# EAGLE design ctp (EAGLE 7.2.0)
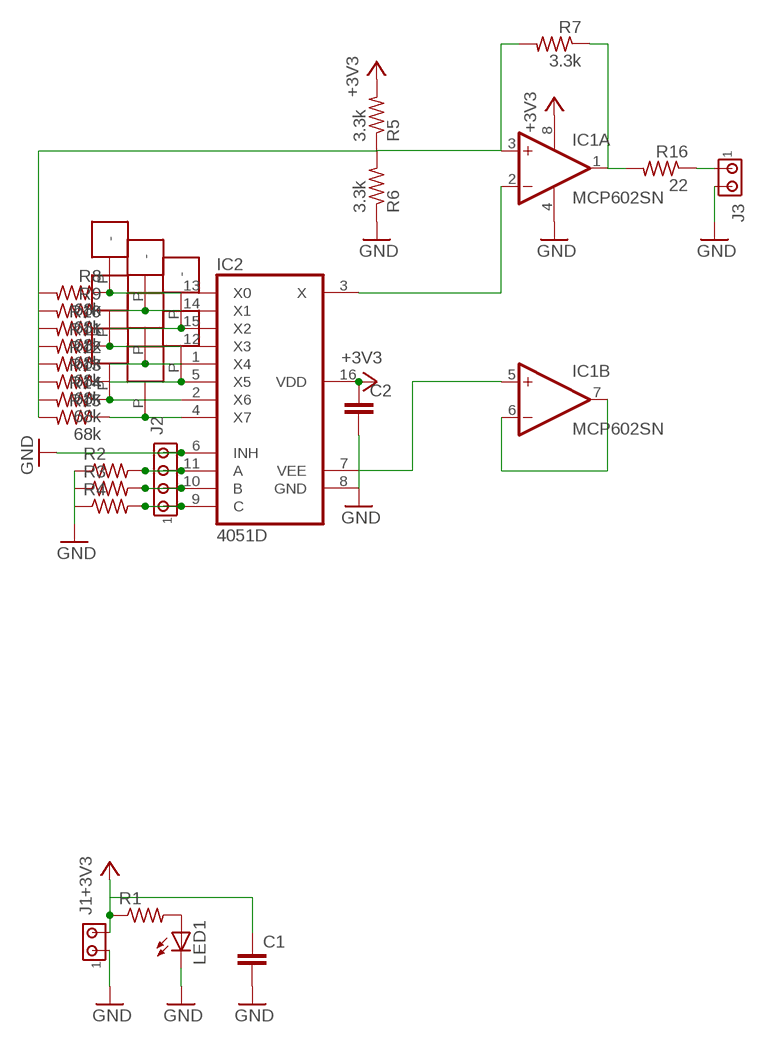
[diagram p0: schematic, sheet 1]

## Parts
C1  C-EUC0805  [C0805]
C2  C-EUC0805  [C0805]
IC1  MCP602SN  [SO08]
IC2  4051D  [SO16]
J1  MTA02-100  [10X02MTA]
J2  MTA04-100  [10X04MTA]
J3  MTA02-100  [10X02MTA]
LED1  LEDCHIP-LED0805  [CHIP-LED0805]
R1  R-US_M0805  [M0805]
R2  R-US_M0805  [M0805]
R3  R-US_M0805  [M0805]
R4  R-US_M0805  [M0805]
R5  3.3k  R-US_M0805  [M0805]
R6  3.3k  R-US_M0805  [M0805]
R7  3.3k  R-US_M0805  [M0805]
R8  68k  R-US_M0805  [M0805]
R9  68k  R-US_M0805  [M0805]
R10  68k  R-US_M0805  [M0805]
R11  68k  R-US_M0805  [M0805]
R12  68k  R-US_M0805  [M0805]
R13  68k  R-US_M0805  [M0805]
R14  68k  R-US_M0805  [M0805]
R15  68k  R-US_M0805  [M0805]
R16  22  R-US_M0805  [M0805]
U$1  BUTTON  [CTP1]
U$2  BUTTON  [CTP1]
U$3  BUTTON  [CTP1]
U$4  BUTTON  [CTP1]
U$5  BUTTON  [CTP1]
U$6  BUTTON  [CTP1]
U$7  BUTTON  [CTP1]
U$8  BUTTON  [CTP1]

## Nets
+3V3: C1.1 C2.1 IC1.8(P:V+) IC2.16(VDD) J1.2 R1.1 R5.2
GND: C1.2 C2.2 IC1.4(P:V-) IC1.5(B:+IN) IC2.6(INH) IC2.7(VEE) IC2.8(GND) J1.1 J2.4 J3.2 LED1.C R2.1 R3.1 R4.1 R6.1
N$1: LED1.A R1.2
N$2: IC2.9(C) J2.1 R4.2
N$3: IC2.11(A) J2.3 R2.2
N$4: IC2.10(B) J2.2 R3.2
N$5: IC1.3(A:+IN) R5.1 R6.2 R7.2 R8.2 R9.2 R10.2 R11.2 R12.2 R13.2 R14.2 R15.2
N$6: IC1.6(B:-IN) IC1.7(B:OUT)
N$7: IC1.1(A:OUT) R7.1 R16.2
N$8: IC1.2(A:-IN) IC2.3(X)
N$9: IC2.13(X0) R8.1 U$1.P(-)
N$10: IC2.14(X1) R9.1 U$2.P(-)
N$11: IC2.15(X2) R10.1 U$3.P(-)
N$12: IC2.12(X3) R11.1 U$4.P(-)
N$13: IC2.1(X4) R12.1 U$5.P(-)
N$14: IC2.5(X5) R13.1 U$6.P(-)
N$15: IC2.2(X6) R14.1 U$7.P(-)
N$16: IC2.4(X7) R15.1 U$8.P(-)
N$17: J3.1 R16.1

## Library data of the parts
C1 C2 = rcl:C-EU: CAPACITOR, European symbol
IC1 = linear:MCP602: Single Op Amp 2.7V to 6.0V Single Supply CMOS Source: http://ww1.microchip.com/downloads/en/DeviceDoc/21314g.pdf
IC2 = 40xx:4051: 8-channel ANALOG MULTIPLEXER
J1 J3 = con-amp:MTA02-100: AMP connector
J2 = con-amp:MTA04-100: AMP connector
LED1 = led:LED: LED OSRAM: - CHIPLED LG R971, LG N971, LY N971, LG Q971, LY Q971, LO R971, LY R971 LH N974, LH R974 LS Q976, LO Q976, LY Q976 LO Q996 - Hyper CHIPLED LW Q18S LB Q993, LB Q99A, LB R99A - SideLED LS A670, LO A670, LY A670, LG A670, LP A670 LB A673, LV A673, LT A673, LW A673 LH A674 LY A675 LS A676, LA A676, LO A676, LY A676, LW A676 LS A679, LY A679, LG A679 - Hyper Micro SIDELED® LS Y876, LA Y876, LO Y876, LY Y876 LT Y87S - SmartLED LW L88C, LW L88S LB L89C, LB L89S, LG L890 LS L89K, LO L89K, LY L89K LS L896, LA L896, LO L896, LY L896 - TOPLED LS T670, LO T670, LY T670, LG T670, LP T670 LSG T670, LSP T670, LSY T670, LOP T670, LYG T670 LG T671, LOG T671, LSG T671 LB T673, LV T673, LT T673, LW T673 LH T674 LS T676, LA T676, LO T676, LY T676, LB T676, LH T676, LSB T676, LW T676 LB T67C, LV T67C, LT T67C, LS T67K, LO T67K, LY T67K, LW E67C LS E67B, LA E67B, LO E67B, LY E67B, LB E67C, LV E67C, LT E67C LW T67C LS T679, LY T679, LG T679 LS T770, LO T770, LY T770, LG T770, LP T770 LB T773, LV T773, LT T773, LW T773 LH T774 LS E675, LA E675, LY E675, LS T675 LS T776, LA T776, LO T776, LY T776, LB T776 LHGB T686 LT T68C, LB T68C - Hyper Mini TOPLED® LB M676 - Mini TOPLED Santana® LG M470 LS M47K, LO M47K, LY M47K Source: http://www.osram.convergy.de LUXEON: - LUMILED® LXK2-PW12-R00, LXK2-PW12-S00, LXK2-PW14-U00, LXK2-PW14-V00 LXK2-PM12-R00, LXK2-PM12-S00, LXK2-PM14-U00 LXK2-PE12-Q00, LXK2-PE12-R00, LXK2-PE12-S00, LXK2-PE14-T00, LXK2-PE14-U00 LXK2-PB12-K00, LXK2-PB12-L00, LXK2-PB12-M00, LXK2-PB14-N00, LXK2-PB14-P00, LXK2-PB14-Q00 LXK2-PR12-L00, LXK2-PR12-M00, LXK2-PR14-Q00, LXK2-PR14-R00 LXK2-PD12-Q00, LXK2-PD12-R00, LXK2-PD12-S00 LXK2-PH12-R00, LXK2-PH12-S00 LXK2-PL12-P00, LXK2-PL12-Q00, LXK2-PL12-R00 Source: www.luxeon.com KINGBRIGHT: KA-3528ASYC Source: www.kingbright.com
R1-R16 = rcl:R-US_: RESISTOR, American symbol
U$1-U$8 = ctp:BUTTON

## Board
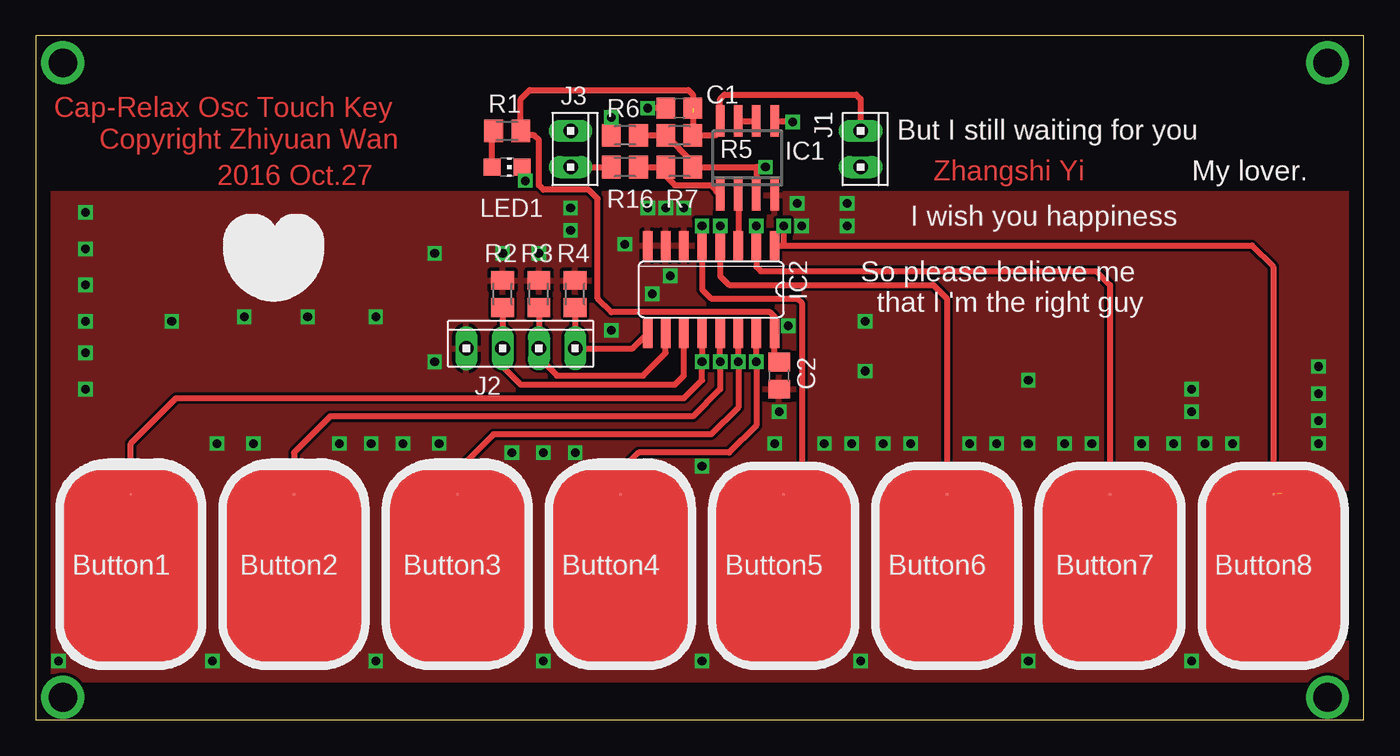
[diagram p1: board, top side]
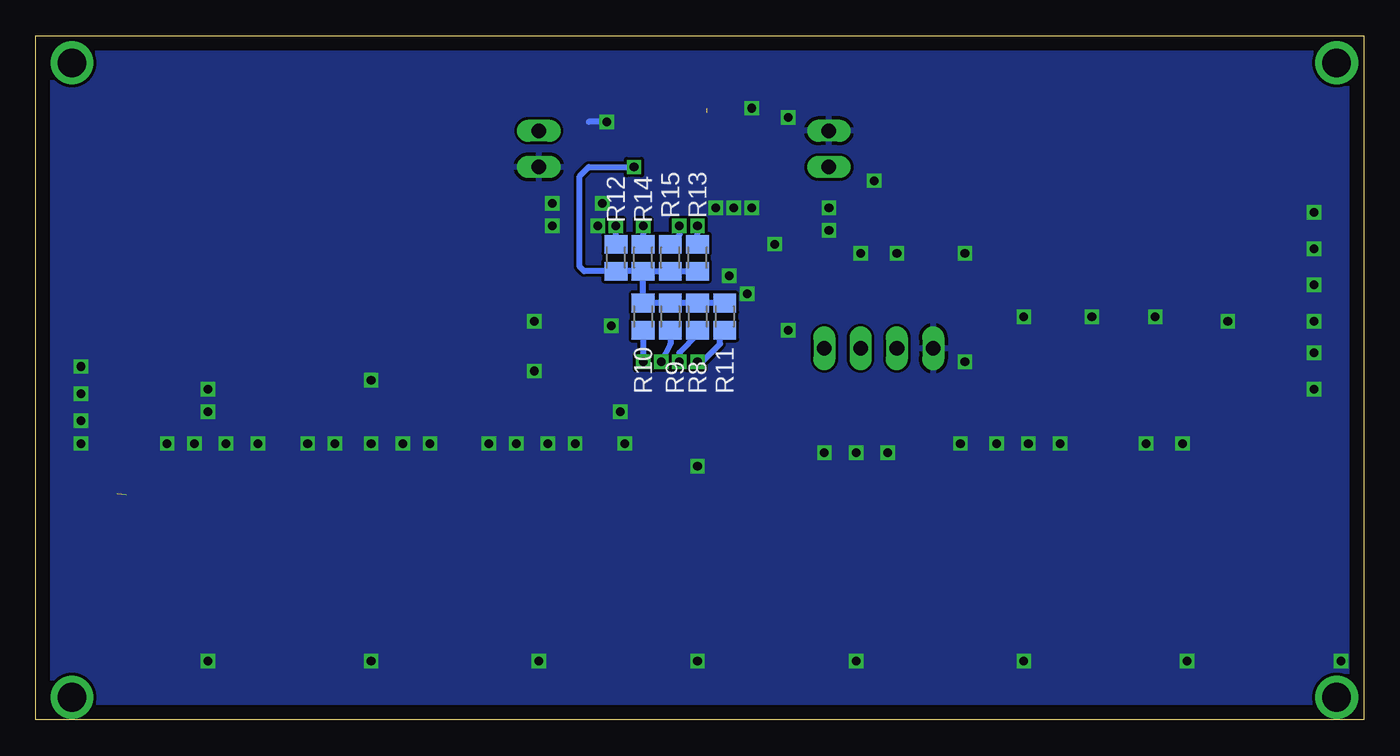
[diagram p2: board, bottom side, seen from below]

Size 93.03 x 47.94 mm. Coordinates in mm from the lower left corner, seen from the top.
Outline: 0,47.94 0,0 93.03,0 93.03,47.94 0,47.94
Copper layers (1*16): Top 0.035mm / dielectric 1.5mm / Bottom 0.035mm
Design rules "default": minimum track width 10mil, minimum drill 24mil, track to track 8mil, track to pad 8mil, pad to pad 8mil, via to via 8mil, smd to smd 8mil, copper to edge 40mil, drill to drill 8mil, minimum pad ring 10mil, minimum via ring 8mil, stop-mask expansion 4mil, vias tented up to drill 0mil, thermal gap 10mil

### Footprints (pad centres in the part's own frame; a part is rotated, then mirrored left to right if it is on the bottom)
C0805 = smd 1.3 x 1.5: 1 -0.95,0; 2 0.95,0
SO08 = smd 0.6 x 2.2: 1 -1.905,-2.6; 2 -0.635,-2.6; 3 0.635,-2.6; 4 1.905,-2.6; 5 1.905,2.6; 6 0.635,2.6; 7 -0.635,2.6; 8 -1.905,2.6
SO16 = smd 0.66 x 2.032: 1 -4.445,-3.073; 2 -3.175,-3.073; 3 -1.905,-3.073; 4 -0.635,-3.073; 5 0.635,-3.073; 6 1.905,-3.073; 7 3.175,-3.073; 8 4.445,-3.073; 9 4.445,3.073; 10 3.175,3.073; 11 1.905,3.073; 12 0.635,3.073; 13 -0.635,3.073; 14 -1.905,3.073; 15 -3.175,3.073; 16 -4.445,3.073
10X02MTA = drill 1.016 long: 1 1.27,0; 2 -1.27,0
10X04MTA = drill 1.016 long: 1 3.81,0; 2 1.27,0; 3 -1.27,0; 4 -3.81,0
CHIP-LED0805 = smd 1.2 x 1.2: A 0,-1.05; C 0,1.05
M0805 = smd 1.3 x 1.6: 1 -0.95,0; 2 0.95,0
CTP1 = smd 0.127 x 0.127: P 0,5

### Placement (x,y rotation side)
C1  45.09,42.86 180 top
C2  52.07,24.13 270 top
IC1  49.85,39.37 0 top
IC2  47.31,30.16 180 top
J1  57.78,40.01 270 top
J2  33.97,26.04 0 top
J3  37.47,40.01 270 top
LED1  33.02,38.73 270 top
R1  33.02,41.27 180 top
R2  32.7,29.84 270 top
R3  35.24,29.84 270 top
R4  37.78,29.84 270 top
R5  45.09,40.96 0 top
R6  41.27,40.96 0 top
R7  45.09,38.73 0 top
R8  46.67,28.26 90 bottom
R9  48.58,28.26 90 bottom
R10  50.48,28.26 90 bottom
R11  44.77,28.26 90 bottom
R12  52.39,32.38 270 bottom
R13  46.67,32.38 270 bottom
R14  50.48,32.38 270 bottom
R15  48.58,32.38 270 bottom
R16  41.27,38.73 0 top
U$1  18.1,10.79 0 top
U$2  29.53,10.79 0 top
U$3  40.96,10.79 0 top
U$4  6.67,10.79 0 top
U$5  86.68,10.79 0 top
U$6  52.39,10.79 0 top
U$7  75.25,10.79 0 top
U$8  63.82,10.79 0 top

### Tracks (layer width: path | path; a pad name or v marks a point on that pad's centre or on a via)
+3V3  (1 unrouted)
  Top 0.406: C2.1 52.07,25.4 51.75,25.72 IC2.16 51.75,28.26 51.44,28.57 40.32,28.57 39.37,29.53 39.37,36.51 38.73,37.15 35.56,37.15 35.24,37.47 35.24,40.64 34.92,40.96 34.29,40.96 R1.1 33.97,43.49 34.61,44.13 45.72,44.13 46.04,43.81 C1.1 | J1.2 57.78,43.5 57.47,43.81 48.26,43.81 47.94,43.5 IC1.8 47.94,41.27 47.62,40.96 R5.2 46.04,42.55
GND  (via drill 0.6)
  Top 0.406: C1.2 v42.86,42.86 | IC1.5 52.96,41.97 v53.02,41.91 | R6.1 40.33,41.59 v40.32,42.23 | LED1.C 34.07,38 v34.29,37.78
  Bottom 0.406: v53.02,41.91 54.29,41.91
  other vias: 12.7,19.37 15.24,19.37 21.27,19.37 23.5,19.37 25.72,19.37 28.26,19.37 33.34,18.73 35.56,18.73 37.78,18.73 46.67,17.78 51.75,19.37 52.07,21.59 55.24,19.37 57.15,19.37 59.37,19.37 61.28,19.37 58.1,27.94 58.1,24.45 65.41,19.37 67.31,19.37 69.53,19.37 72.07,19.37 69.53,23.81 73.98,19.37 77.47,19.37 79.69,19.37 81.92,19.37 83.82,19.37 80.96,21.59 80.96,23.18 89.85,19.37 89.85,20.95 89.85,22.86 89.85,24.77 45.4,35.88 44.13,35.88 42.86,35.88 41.27,33.34 43.18,29.84 44.45,31.11 37.47,35.88 37.47,34.29 40.32,27.3 27.94,25.08 35.24,32.7 3.49,35.56 3.49,33.02 3.49,30.48 3.49,27.94 3.49,25.72 3.49,23.18 52.7,27.62 53.34,36.2 56.83,36.2 56.83,34.61 53.66,34.61 32.7,32.7 27.94,32.7 9.53,27.94 14.61,28.26 19.05,28.26 23.81,28.26 12.38,4.13 1.59,4.13 23.81,4.13 35.56,4.13 46.67,4.13 57.78,4.13 69.53,4.13 80.96,4.13
  pour Bottom: 0,47.62 92.71,47.62 92.71,0 0,0
  pour Top: 0.32,36.83 0.32,2.86 93.34,2.86 93.34,36.83
N$1
  Top 0.406: LED1.A 31.97,41.17 R1.2
N$2
  Top 0.406: IC2.9 41.81,26.04 J2.1 R4.2
N$3
  Top 0.406: 45.4,27.62 IC2.11 45.4,24.13 44.77,23.5 33.97,23.5 32.7,24.77 J2.3 R2.2
N$4
  Top 0.406: IC2.10 44.13,25.72 42.55,24.13 36.51,24.13 35.24,25.4 J2.2 R3.2
N$5  (via drill 0.6)
  Top 0.406: R6.2 R5.1 46.03,39.06 R7.2 50.48,38.73 | 50.48,38.73 IC1.3 | v51.12,38.73 50.48,38.73
  Bottom 0.406: R14.2 R15.2 R13.2 | R14.2 R10.2 R9.2 R8.2 R11.2 | R14.2 R12.2 | R14.2 54.61,31.43 54.93,31.75 54.93,38.1 54.29,38.73 v51.12,38.73
N$6
  Top 0.406: IC1.7 IC1.6
N$7
  Top 0.406: IC1.1 47.62,37.09 47.62,37.15 47.31,37.47 44.77,37.47 44.13,38.1 R7.1 R16.2
N$8
  Top 0.406: IC1.2 IC2.3
N$9  (via drill 0.6)
  Top 0.406: U$1.P 18.1,18.73 20.64,21.27 46.04,21.27 47.94,23.18 v47.94,25.08 IC2.13
  Bottom 0.406: R8.1 46.67,26.99 47.94,25.72 v47.94,25.08
N$10  (via drill 0.6)
  Top 0.406: U$2.P 29.53,17.46 32.07,20 47.31,20 49.21,21.91 v49.21,25.08 IC2.14
  Bottom 0.406: R9.1 48.58,26.35 v49.21,25.08
N$11  (via drill 0.6)
  Top 0.406: U$3.P 40.96,17.46 42.23,18.73 48.58,18.73 50.48,20.64 v50.48,25.08 IC2.15
  Bottom 0.406: R10.1 v50.48,25.08
N$12  (via drill 0.6)
  Top 0.406: IC2.12 v46.67,25.08 46.67,23.81 45.4,22.54 9.84,22.54 6.67,19.37 U$4.P
  Bottom 0.406: v46.67,25.08 46.35,25.08 45.09,26.35 45.09,26.99 R11.1
N$13  (via drill 0.6)  (1 unrouted)
  Top 0.406: IC2.1 52.39,33.24 | 52.39,33.24 85.19,33.24 86.68,31.75 86.68,16.51 87.31,15.88 | v52.39,34.61 52.39,33.24
  Bottom 0.406: R12.1 v52.39,34.61
N$14  (via drill 0.6)
  Top 0.406: U$6.P 53.66,17.07 53.66,29.21 53.34,29.53 47.31,29.53 46.67,30.16 IC2.5 v46.67,34.61
  Bottom 0.406: R13.1 v46.67,34.61
N$15  (via drill 0.6)
  Top 0.406: U$7.P 75.25,30.48 74.3,31.43 50.8,31.43 50.48,31.75 IC2.2 v50.48,34.61
  Bottom 0.406: v50.48,34.61 R14.1
N$16  (via drill 0.6)
  Top 0.406: U$8.P 63.9,15.88 64.45,15.88 63.82,16.51 63.82,29.53 62.87,30.48 48.58,30.48 47.94,31.11 IC2.4 v47.94,34.61
  Bottom 0.406: v47.94,34.61 47.94,33.97 R15.1
N$17
  Top 0.406: J3.1 R16.1
N$18  (via drill 2)
  other vias: 1.91,46.04
N$19  (via drill 2)
  other vias: 90.49,46.04
N$20  (via drill 2)
  other vias: 90.49,1.59
N$21  (via drill 2)
  other vias: 1.91,1.59

### Text on the board
Top: Cap-Relax Osc Touch Key | Copyright Zhiyuan Wan | Zhangshi Yi | 2016 Oct.27
tPlace: But I still waiting for you | My lover. | I wish you happiness | So please believe me / that I 'm the right guy | Button1 | Button2 | Button3 | Button4 | Button5 | Button6 | Button7 | Button8
tCream: Zhangshi Yi